# EAGLE schematic ENC424J600-KART (EAGLE 9.6.2)
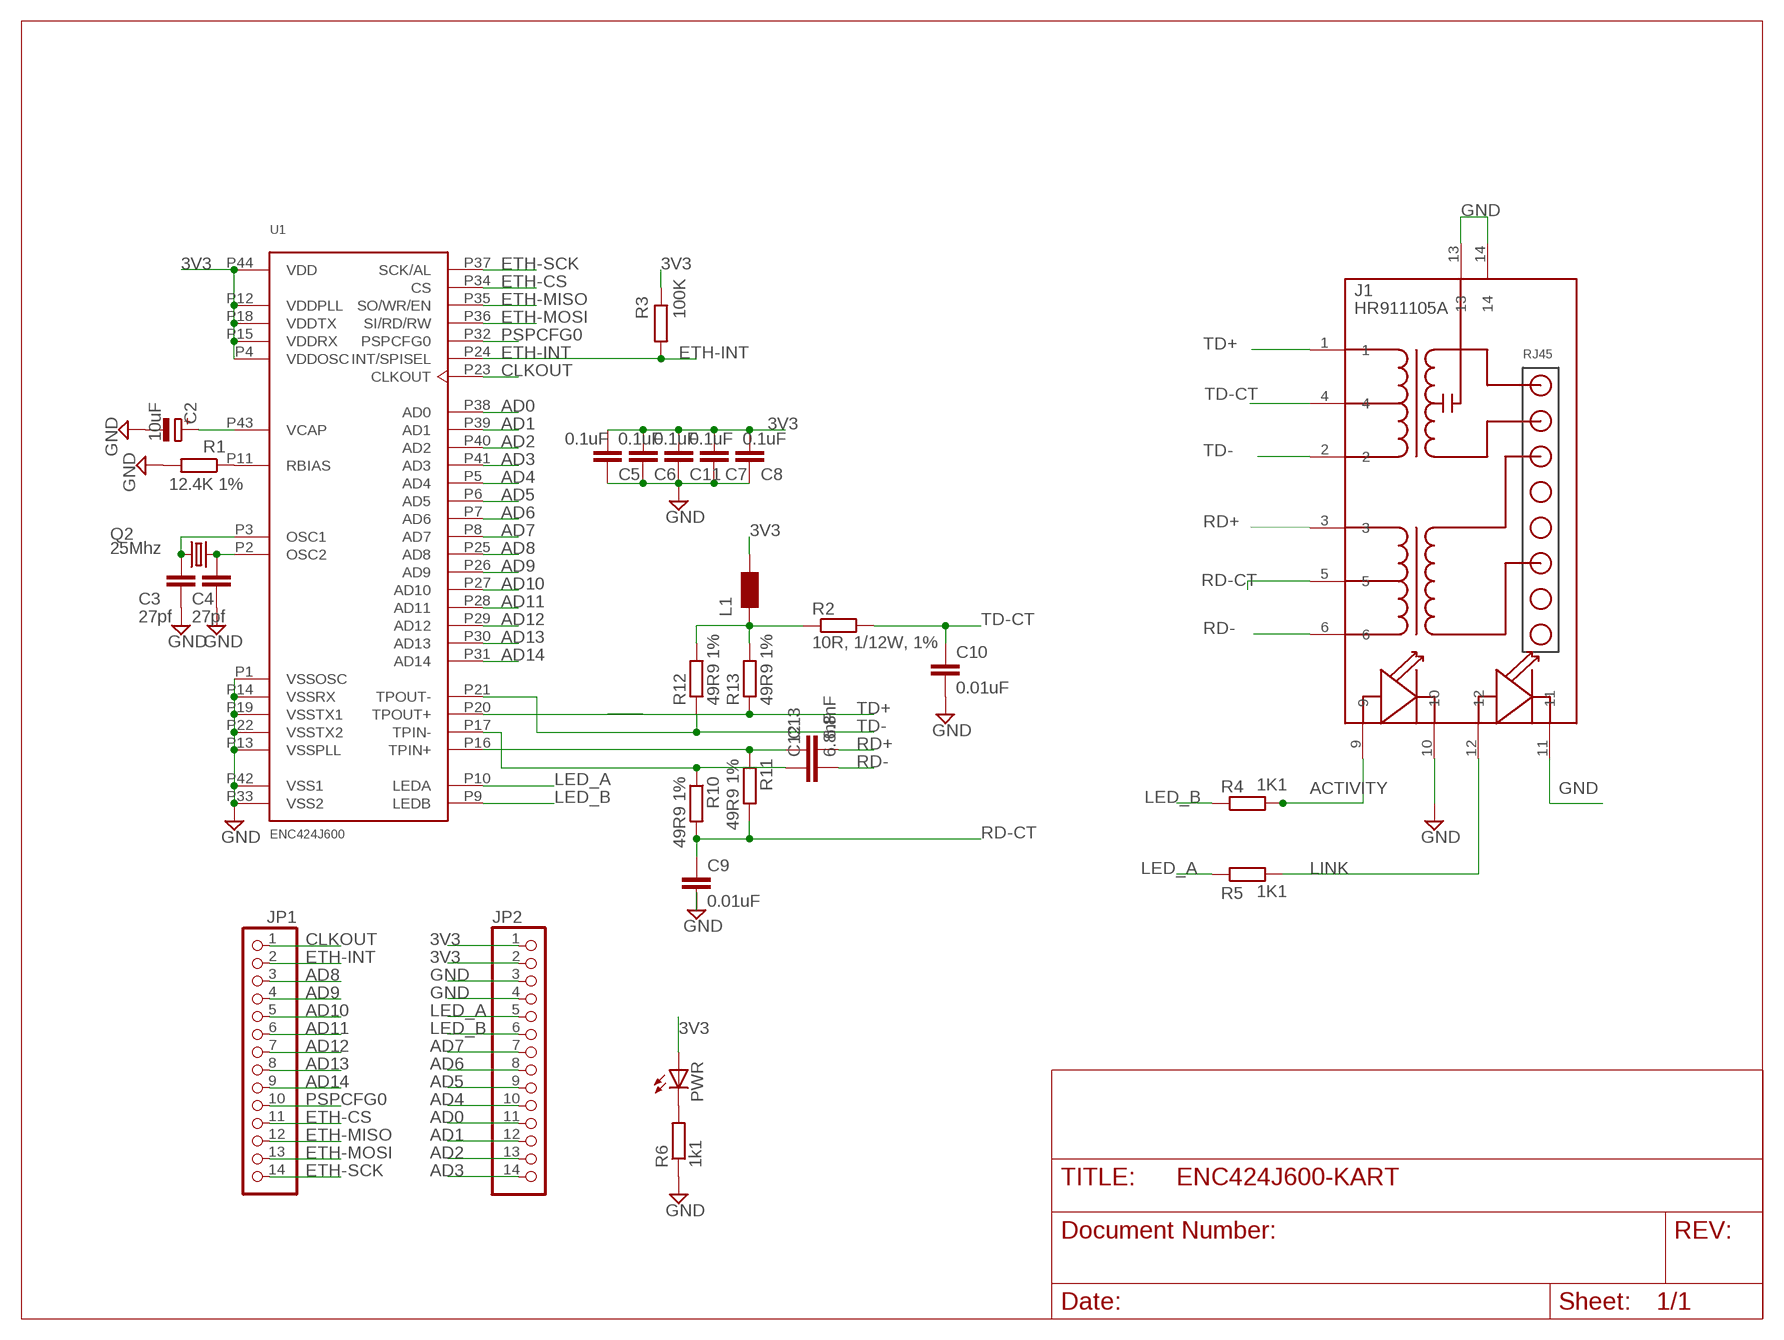
[diagram p0: schematic, sheet 1]

## Parts
C2  10uF  CPOL-EUSMCA  [SMC_A]
C3  27pf  C-EUC0603  [C0603]
C4  27pf  C-EUC0603  [C0603]
C5  0.1uF  C-EUC0603  [C0603]
C6  0.1uF  C-EUC0603  [C0603]
C7  0.1uF  C-EUC0603  [C0603]
C8  0.1uF  C-EUC0603  [C0603]
C9  0.01uF  C-EUC0603  [C0603]
C10  0.01uF  C-EUC0603  [C0603]
C11  0.1uF  C-EUC0603  [C0603]
C12  6.8nF  C-EUC0603  [C0603]
C13  6.8nF  C-EUC0603  [C0603]
J1  HR911105A  [HR911105A]
JP1  PINHD-1X14  [1X14]
JP2  PINHD-1X14  [1X14]
L1  WE-KIL_0805  [WE-KI_0805_B]
PWR  LED805  [LED-805]
Q2  25Mhz  CRYSTALHC49UP  [HC49UP]
R1  12.4K 1%  R-EU_R0603  [R0603]
R2  10R, 1/12W, 1%  R-EU_R0603  [R0603]
R3  100K  R-EU_R0603  [R0603]
R4  1K1  R-EU_R0603  [R0603]
R5  1K1  R-EU_R0603  [R0603]
R6  1k1  R-EU_R0603  [R0603]
R10  49R9 1%  R-EU_R0603  [R0603]
R11  49R9 1%  R-EU_R0603  [R0603]
R12  49R9 1%  R-EU_R0603  [R0603]
R13  49R9 1%  R-EU_R0603  [R0603]
U1  ENC424J600  [TQFP44]

## Nets
3V3: C5.1 C6.1 C7.1 C8.1 C11.1 JP2.1 JP2.2 L1.1 PWR.A R3.1 U1.P4(VDDOSC) U1.P12(VDDPLL) U1.P15(VDDRX) U1.P18(VDDTX) U1.P44(VDD)
ACTIVITY: J1.9 R4.2
AD0: JP2.11 U1.P38(AD0)
AD1: JP2.12 U1.P39(AD1)
AD2: JP2.13 U1.P40(AD2)
AD3: JP2.14 U1.P41(AD3)
AD4: JP2.10 U1.P5(AD4)
AD5: JP2.9 U1.P6(AD5)
AD6: JP2.8 U1.P7(AD6)
AD7: JP2.7 U1.P8(AD7)
AD8: JP1.3 U1.P25(AD8)
AD9: JP1.4 U1.P26(AD9)
AD10: JP1.5 U1.P27(AD10)
AD11: JP1.6 U1.P28(AD11)
AD12: JP1.7 U1.P29(AD12)
AD13: JP1.8 U1.P30(AD13)
AD14: JP1.9 U1.P31(AD14)
CCT: L1.2 R2.1 R12.2 R13.2
CLKOUT: JP1.1 U1.P23(CLKOUT)
DSFGDF: C12.1 R10.1 U1.P17(TPIN-)
DSGDFSG: C13.1 R11.1 U1.P16(TPIN+)
ETH-CS: JP1.11 U1.P34(CS)
ETH-INT: JP1.2 R3.2 U1.P24(INT/SPISEL)
ETH-MISO: JP1.12 U1.P35(SO/WR/EN)
ETH-MOSI: JP1.13 U1.P36(SI/RD/RW)
ETH-SCK: JP1.14 U1.P37(SCK/AL)
GND: C2.- C3.2 C4.2 C5.2 C6.2 C7.2 C8.2 C9.2 C10.2 C11.2 J1.10 J1.11 J1.13 J1.14 JP2.3 JP2.4 R1.2 R6.1 U1.P1(VSSOSC) U1.P13(VSSPLL) U1.P14(VSSRX) U1.P19(VSSTX1) U1.P22(VSSTX2) U1.P33(VSS2) U1.P42(VSS1)
LED_A: JP2.5 R5.1 U1.P10(LEDA)
LED_B: JP2.6 R4.1 U1.P9(LEDB)
LINK: J1.12 R5.2
N$1: C2.+ U1.P43(VCAP)
N$2: R1.1 U1.P11(RBIAS)
N$3: PWR.C R6.2
N$4: C3.1 Q2.1 U1.P3(OSC1)
N$8: C4.1 Q2.2 U1.P2(OSC2)
PSPCFG0: JP1.10 U1.P32(PSPCFG0)
RD+: C13.2 J1.3
RD-: C12.2 J1.6
RD-CT: C9.1 J1.5 R10.2 R11.2
TD+: J1.1 R13.1 U1.P20(TPOUT+)
TD-: J1.2 R12.1 U1.P21(TPOUT-)
TD-CT: C10.1 J1.4 R2.2

## Library data of the parts
C2 = rcl:CPOL-EU: POLARIZED CAPACITOR, European symbol
C3-C13 = rcl:C-EU: CAPACITOR, European symbol
J1 = CONNECTER:HR911105A
JP1 JP2 = pinhead - Copy:PINHD-1X14: PIN HEADER
L1 = wuerth-elektronik:WE-KIL: SMD Wire Wound Ceramic Inductor WE-KIL - Low profile - High Q values -- Bluetooth -- Wireless LAN -- RF oscillation circuit -- IF impedance matching
PWR = dp_devices:LED
Q2 = crystal:CRYSTAL: CRYSTAL
R1-R6 R10-R13 = rcl:R-EU_: RESISTOR, European symbol
U1 = dp_devices:ENC424J600: Stand-Alone 10/100 Ethernet Controller with SPI or Parallel Interface Source: http://ww1.microchip.com/downloads/en/DeviceDoc/39935c.pdf